# EasyEDA Pro project Main.eprj, board k230D
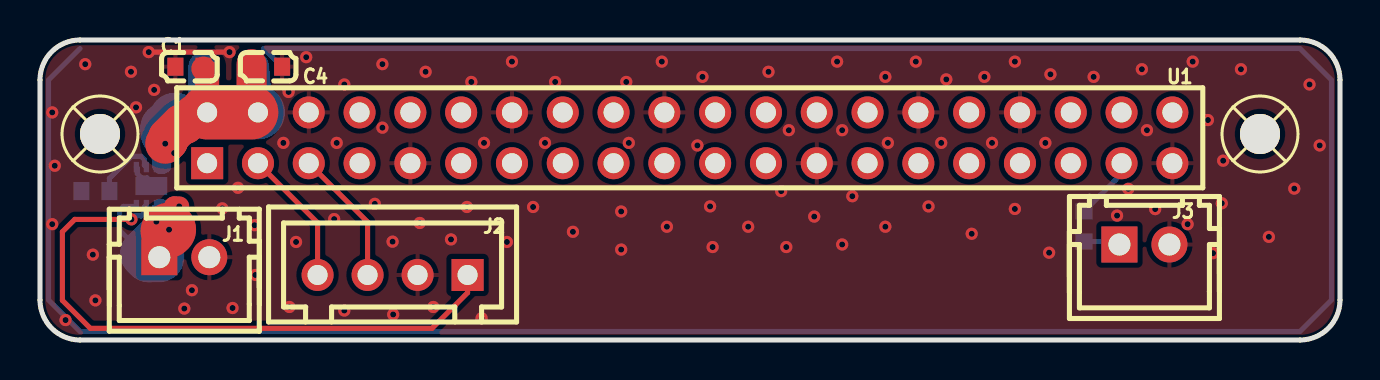
[diagram p11: board, top side]
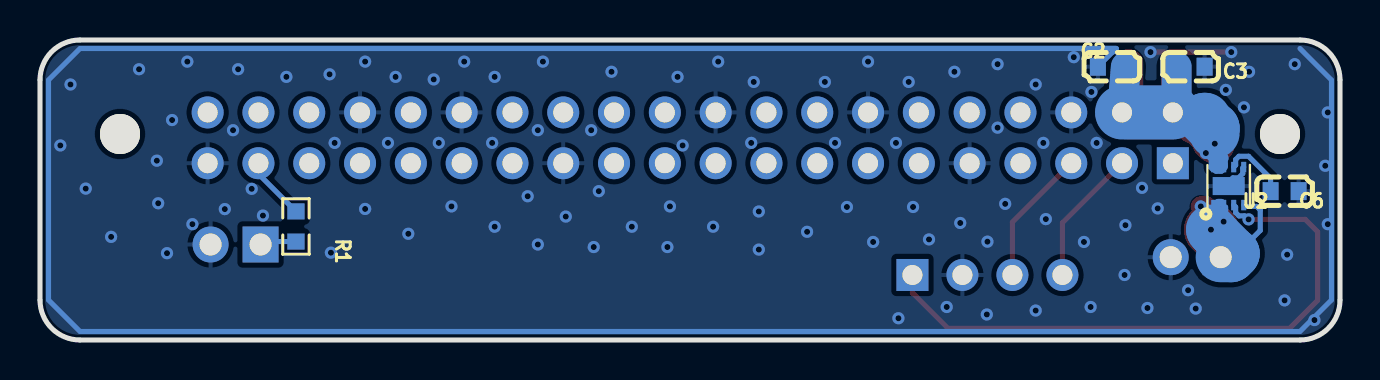
[diagram p12: board, bottom side, seen from below]

Outline 65 x 15 mm; copper layers: Top Layer, Bottom Layer. Coordinates in mm from the lower left corner of the outline.
Outline path: 0,13 arc(0.59,14.41) 2,15 63,15 arc(64.41,14.41) 65,13 65,2 arc(64.41,0.59) 63,0 2,0 arc(0.59,0.59) 0,2 0,13
Stack: Top Layer 0.035mm / Dielectric1 1.51mm FR4 er 4.5 / Bottom Layer 0.035mm

## Design rules (mm)
template: Custom Config
spacing copperThickness1oz (default): track to track 0.102, other pairs 0.152 to 0.3
spacing copperThickness2oz: track to track 0.203, other pairs 0.152 to 0.3
track width copperThickness1oz (default): min 0.127, default 0.254, max 7
track width copperThickness2oz: min 0.203, default 0.254, max 7
differential pair differentialPair (default): width min 0.127, default 0.254, max 2.54; gap min 0.152, default 0.152
via viaSize (default): diameter min 0.5, default 0.61, max 10; hole min 0.3, default 0.305, max 6.3

## Placement (name value [footprint] x y rotation side)
C1  100nF  [C0603]  7.47 13.67 180 top
C2  1uF  [C0603]  11.41 13.67 0 bottom
C3  22uF  [C0603]  7.47 13.67 180 bottom
C4  47uF  [C0603]  11.41 13.67 0 top
C6  10nF  [C0603]  2.77 7.44 0 bottom
J1  K230 pow  [CONN-TH_2P-P2.50_HX25003-2A]  7.22 4.14 0 top
J2  k230D UART  [CONN-TH_B4B-XH-A-BK-LF-SN]  17.63 3.25 180 top
J3  K230 buzzer  [CONN-TH_2P-P2.50_HX25003-2A]  55.22 4.78 0 top
R1  1kΩ  [R0603]  52.2 5.68 90 bottom
SCREW2  -  [Screw-Hole-M2]  61 10.3 180 top
SCREW4  -  [Screw-Hole-M2]  3 10.3 180 top
U1  FH-00148  [HDR-TH_40P-P2.54_FFH25405-D40S1001K6K]  32.49 10.11 0 top
U2  TPS22975DSGR  [WSON-8_L2.0-W2.0-P0.50-TL-EP]  5.56 7.7 90 bottom

## Footprints (pads in the part's own frame, mm; a bottom-side part is the same pattern mirrored in y, then rotated)
C0603
  rect 0.8x0.9 smd: 1(-0.7,0) 2(0.7,0)
CONN-TH_2P-P2.50_HX25003-2A
  rect 1.8x1.8 hole 1.1: 1(-1.25,0)
  round 1.8 hole 1.1: 2(1.25,0)
CONN-TH_B4B-XH-A-BK-LF-SN
  rect 1.6x1.6 hole 1: 1(-3.75,0)
  round 1.6 hole 1: 2(-1.25,0) 3(1.25,0) 4(3.75,0)
HDR-TH_40P-P2.54_FFH25405-D40S1001K6K
  rect 1.6x1.6 hole 1: 1(-24.13,-1.27)
  round 1.6 hole 1: 2(-24.13,1.27) 3(-21.59,-1.27) 4(-21.59,1.27) 5(-19.05,-1.27) 6(-19.05,1.27) 7(-16.51,-1.27) 8(-16.51,1.27) 9(-13.97,-1.27) 10(-13.97,1.27) 11(-11.43,-1.27) 12(-11.43,1.27) 13(-8.89,-1.27) 14(-8.89,1.27) 15(-6.35,-1.27) 16(-6.35,1.27) 17(-3.81,-1.27) 18(-3.81,1.27) 19(-1.27,-1.27) 20(-1.27,1.27) 21(1.27,-1.27) 22(1.27,1.27) 23(3.81,-1.27) 24(3.81,1.27) 25(6.35,-1.27) 26(6.35,1.27) 27(8.89,-1.27) 28(8.89,1.27) 29(11.43,-1.27) 30(11.43,1.27) 31(13.97,-1.27) 32(13.97,1.27) 33(16.51,-1.27) 34(16.51,1.27) 35(19.05,-1.27) 36(19.05,1.27) 37(21.59,-1.27) 38(21.59,1.27) 39(24.13,-1.27) 40(24.13,1.27)
R0603
  rect 0.806x0.864 smd: 1(-0.753,0) 2(0.753,0)
Screw-Hole-M2
  round 2 hole 2: 1(0,0)
WSON-8_L2.0-W2.0-P0.50-TL-EP
  rect 0.521x0.25 smd: 1(-0.95,0.75) 2(-0.95,0.25) 3(-0.95,-0.25) 4(-0.95,-0.75) 5(0.95,-0.75) 6(0.95,-0.25) 7(0.95,0.25) 8(0.95,0.75)
  rect 0.9x1.6 smd: 9(0,0)

## Nets
As in the schematic.

Pads without a net: SCREW2 1; SCREW4 1; U1 1 7 8 10 11 12 13 15 16 17 18 19 21 22 23 24 26 27 28 29 31 32 33 35 36 38 40

## Via types
v1: diameter 0.61, hole 0.305, Top Layer to Bottom Layer, 105 vias

## Routing (per net, layer and track width the routed paths; a pad name or vN(x,y) marks a point on that pad's centre or on a via; arc(x,y) is an arc through that point)
+5V: length 7.1
  Top Layer w1: 6.71,5.77 6.71,6.68 v1(6.96,6.68)
  Top Layer w2.7: v1(6.45,5.52) 6.38,5.44
  Bottom Layer w0.254: U2.4 4.75,6.68 4.17,6.68 3.99,6.5 3.99,5.48 4.57,4.89 ; 5.72,6.65 5.72,6.43
  Bottom Layer w0.4: 6.2,6.75 6.09,6.86 5.92,6.86
  Bottom Layer w2.5: J1.1 5.45,4.14 5.26,4.32 5.28,4.32 6.28,5.32 6.28,5.34 6.45,5.52
  vias: v1(5.82,5.92)
K230_ENABLE: length 30.8
  Top Layer w0.254: J2.1 21.38,2.36 19.6,0.58 2.52,0.58 1.12,1.98 1.12,5.41 1.74,6.03 v1(4.57,6.03)
  Bottom Layer w0.254: v1(4.57,6.03) 4.6,6.03 4.77,6.21 5.05,6.21 5.22,6.37 5.22,6.65 U2.3
K230D_BUZZER: length 3.2
  Bottom Layer w0.254: U1.37 54.08,8.31 R1.2
K230RX: length 6.8
  Top Layer w0.254: J2.4 13.88,5.86 U1.3
K230TX: length 6.8
  Top Layer w0.254: U1.5 16.38,5.9 J2.3
POWER_GND: length 150.5
  Top Layer w0.254: v1(9.47,14.39) v1(5.44,14.39)
  Bottom Layer w0.254: 2,14.57 0.43,13 0.43,2 2,0.43 63,0.43 64.57,2 64.57,13 63,14.57 11.18,14.57 11.36,14.39 11.38,14.39 C4.2 ; U2.5 4.86,8.6 4.86,8.32 5.07,8.11 5.35,8.11 5.56,7.9 U2.9
  vias: v1(0.61,11.38) v1(0.61,5.79) v1(0.74,8.71) v1(1.28,1) v1(2.26,13.79) v1(2.64,4.27) v1(2.77,1.98) v1(4.55,13.41) v1(4.8,11.63) v1(5.71,12.51) v1(7.22,1.57) v1(7.6,2.49) v1(9.12,6.58) v1(9.63,1.6) v1(9.9,7.61) v1(10.73,5.74) v1(10.77,3.25) v1(12.17,9.86) v1(12.43,12.4) v1(12.47,1.65) v1(12.8,4.9) v1(13.31,14.14) v1(14.71,6.05) v1(14.84,9.86) v1(15.22,12.78) v1(15.22,1.47) v1(16.74,6.81) v1(17.12,13.79) v1(17.12,10.62) v1(17.63,4.92) v1(17.66,1.28) v1(18.99,5.85) v1(19.28,13.41) v1(19.66,1.65) v1(20.55,5.03) v1(21.35,6.65) v1(21.57,12.9) v1(22.08,1.09) v1(22.2,9.86) v1(23.34,4.9) v1(23.6,13.92) v1(24.66,6.65) v1(25.25,9.86) v1(25.76,12.9) v1(26.65,5.41) v1(29.06,6.43) v1(29.06,4.52) v1(29.31,12.9) v1(29.44,9.86) v1(31.09,13.92) v1(31.34,5.66) v1(32.87,9.73) v1(33.12,13.16) v1(33.5,6.68) v1(33.63,4.65) v1(35.41,5.66) v1(36.43,13.41) v1(37.06,7.44) v1(37.31,4.65) v1(37.44,10.49) v1(38.71,6.17) v1(39.85,13.92) v1(40.11,10.49) v1(40.11,4.78) v1(40.62,7.19) v1(42.27,13.16) v1(42.27,5.66) v1(42.39,9.86) v1(43.79,13.92) v1(44.43,6.68) v1(45.06,9.86) v1(45.31,13.03) v1(46.59,5.31) v1(47.22,13.16) v1(47.6,9.86) v1(48.74,13.92) v1(48.74,6.55) v1(50.27,9.86) v1(50.52,13.28) v1(50.46,4.37) v1(52.68,13.16) v1(53.85,6.22) v1(54.41,7.56) v1(55.09,13.54) v1(55.35,10.49) v1(55.76,6.55) v1(57.38,5.79) v1(57.63,13.92) v1(58.4,11) v1(58.65,4.34) v1(59.09,6.84) v1(59.16,8.97) v1(60.05,13.54) v1(61.44,5.16) v1(62.71,7.57) v1(63.48,12.78) v1(63.98,9.73)
$1N12541: length 20.6
  Top Layer w1.2: U1.2 8.36,13.38 8.17,13.57
  Top Layer w1.5: 10.57,11.38 10.58,11.39 10.58,13.79
  Top Layer w2: v1(6.26,9.82) 6.41,9.96 6.41,10.12 7.08,10.79 7.24,10.79 7.71,11.26
  Top Layer w2.7: 10.57,11.38 U1.2
  Bottom Layer w0.4: U2.7 5.95,8.51 6.18,8.51 U2.8
  Bottom Layer w0.5: 5.82,9.1 5.86,9.14 5.86,8.73 5.88,8.71 ; 7.6,10.36 6.31,9.08 U2.8
  Bottom Layer w1.5: C4.1 U1.4 ; U1.2 8.17,11.57 8.17,13.67
  Bottom Layer w2.5: 6.79,11.11 6.27,10.59 ; 6.27,10.59 6.27,10.62 ; 6.27,10.59 6.27,10.34 ; 6.72,11.11 6.76,11.11
  Bottom Layer w2.7: U1.2 U1.4
  vias: v1(6.71,9.35)
$1N12598: length 1.9
  Bottom Layer w0.254: 53.97,4.52 53.57,4.92 R1.1
$1N87576: length 3.3
  Bottom Layer w0.254: C6.2 3.47,8.08 4.57,9.19 5.05,9.19 5.22,9.02 5.22,8.74 U2.6

## Copper pours and planes (outline as drawn; the poured copper is in the pictures)
POWER_GND on Top Layer: -1.02,16.19 65.91,16.19 65.91,-1.33 -1.02,-1.33
POWER_GND on Bottom Layer: -2.29,16.96 65.15,16.96 65.15,-2.86 -2.29,-2.86
